# EAGLE design BlinkyTile Controller (EAGLE 7.7.0)
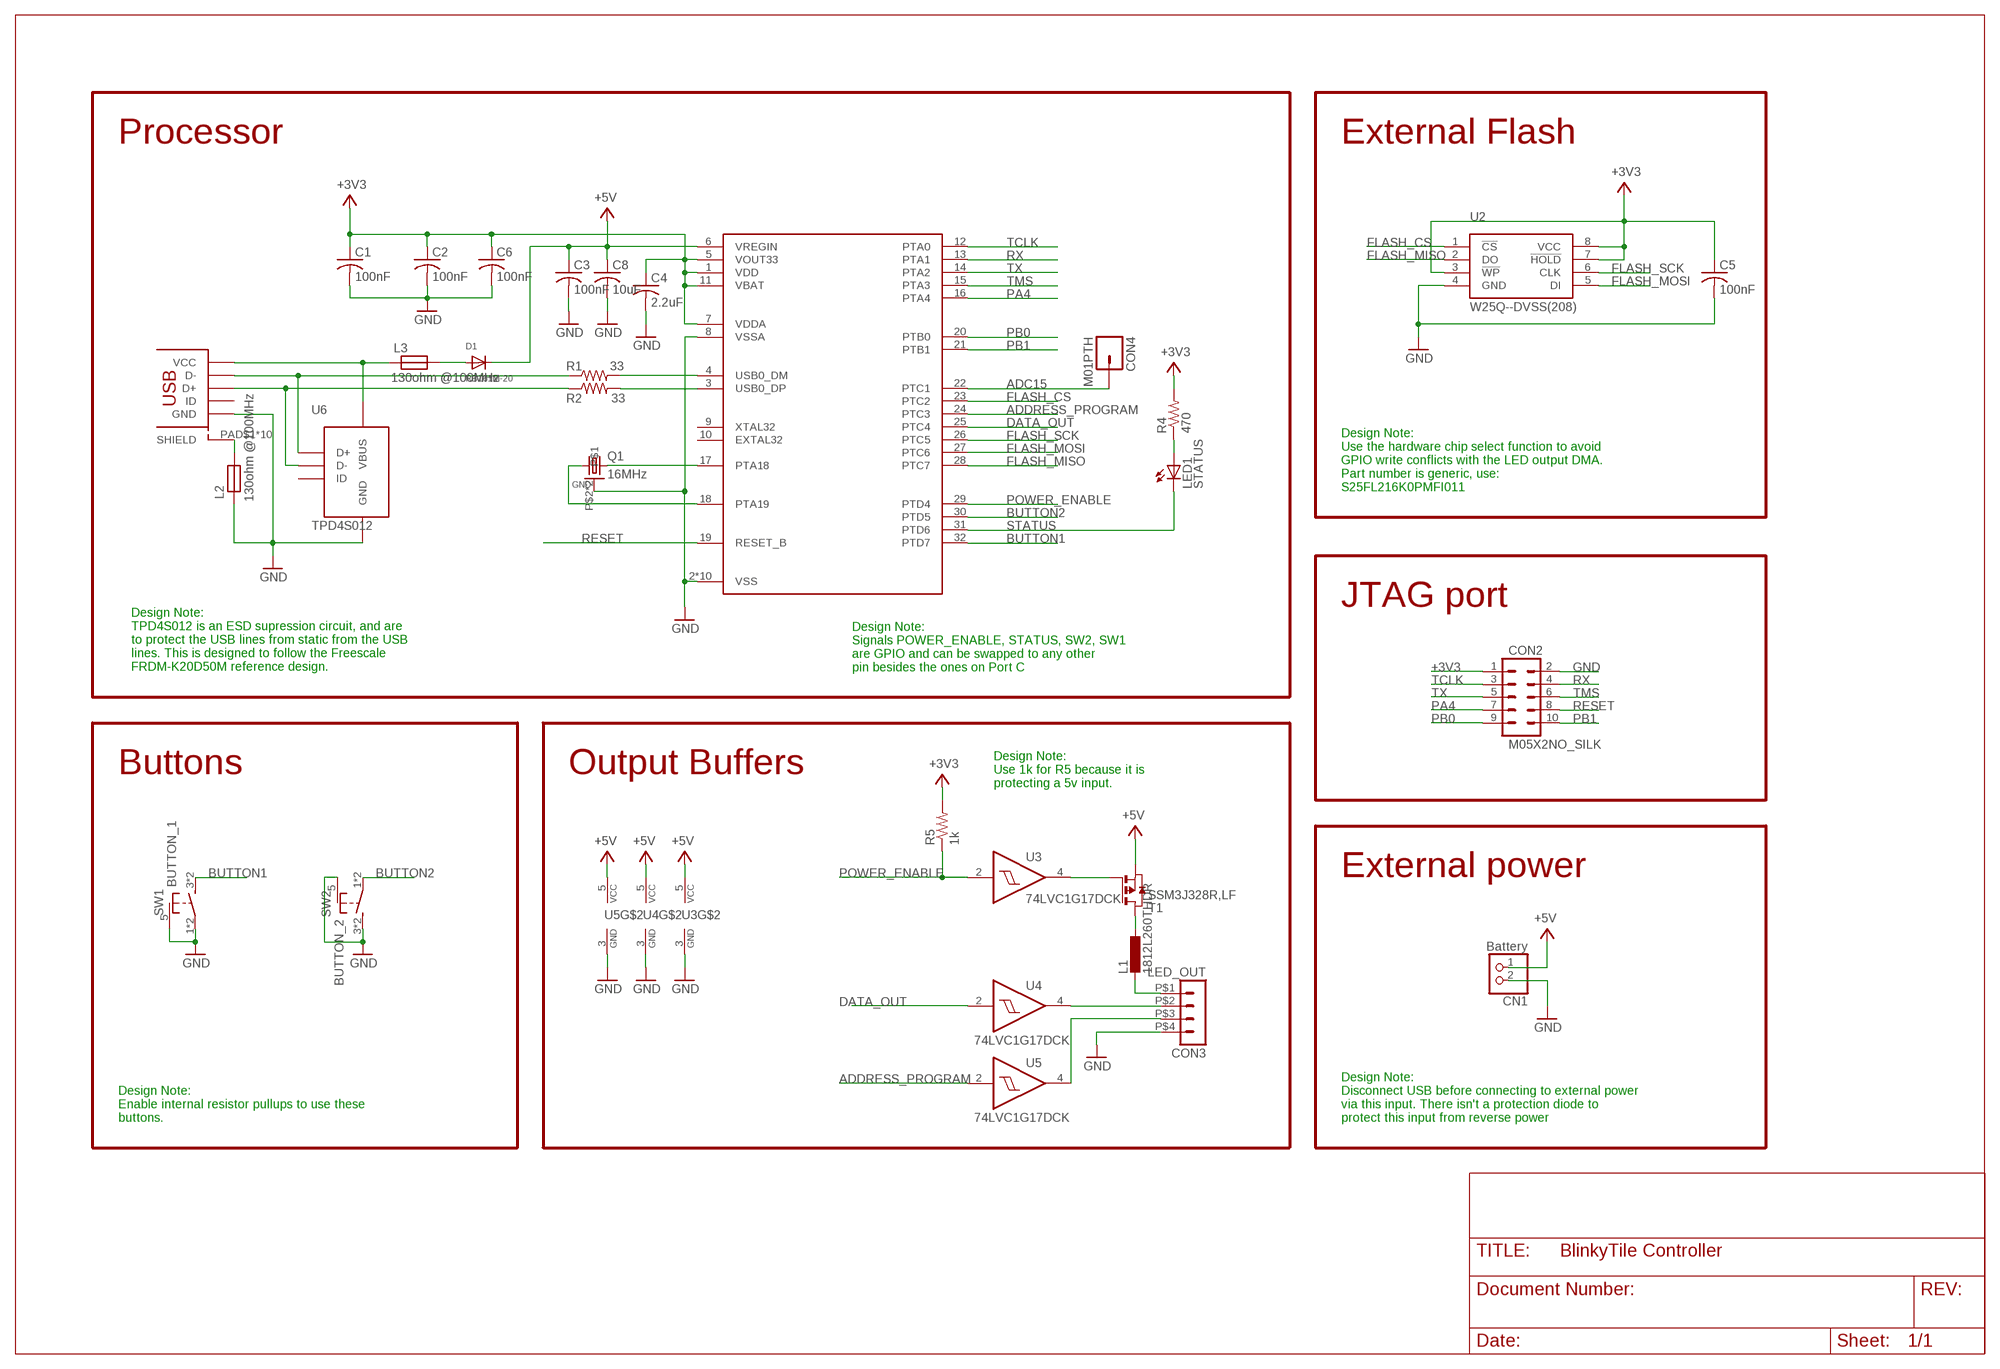
[diagram p0: schematic, sheet 1]

## Parts
C1  100nF  C-USC0402  [C0402]
C2  100nF  C-USC0402  [C0402]
C3  100nF  C-USC0402  [C0402]
C4  2.2uF  C-USC0402  [C0402]
C5  100nF  C-USC0402  [C0402]
C6  100nF  C-USC0402  [C0402]
C8  10uF  C-USC0805K  [C0805K]
CN1  Battery  JST_2PIN-THM-RA  [JST-PH-2-THM-RA]
CON1  USB_MICROSMT+THRUHULE  [USB_MICRO_THRUHOLE]
CON2  M05X2NO_SILK  [2X5_NOSILK]
CON3  LED_OUT  4-PIN_DUPONT  [DUPONT-4P]
CON4  M01PTH  [1X01]
D1  RB161M-20  DIODESOD-123  [SOD-123]
L1  1812L260THDR  L-EUL1812  [L1812]
L2  130ohm @100MHz  FB0805/NO-OUTLINE  [0805]
L3  130ohm @100MHz  FB0805/NO-OUTLINE  [0805]
LED1  STATUS  LEDCHIPLED_0805  [CHIPLED_0805]
Q1  16MHz  CRYSTAL_4PAD2520  [CRSYTAL_2520]
R1  33  R-US_R0402  [R0402]
R2  33  R-US_R0402  [R0402]
R4  470  R-US_R0402  [R0402]
R5  1k  R-US_R0402  [R0402]
SW1  BUTTON_1  BUTTON_MOMENTARY_GROUND  [TD-07XB]
SW2  BUTTON_2  BUTTON_MOMENTARY_GROUND  [TD-07XB]
T1  SSM3J328R,LF  PMOSSOT23  [SOT-23]
U1  MK20D--VFM5  [QFN32_5X5_LONGLEADS]
U2  W25Q--DVSS(208)  [SOIC8-208]
U3  74LVC1G17DCK  [SC70-5]
U4  74LVC1G17DCK  [SC70-5]
U5  74LVC1G17DCK  [SC70-5]
U6  TPD4S012  [R-PUSON-N6]

## Nets
+3V3: C1.1 C2.1 C4.1 C5.1 C6.1 CON2.1 R4.2 R5.2 U1.1(VDD) U1.5(VOUT33) U1.7(VDDA) U1.11(VBAT) U2.3(!WP) U2.7(!HOLD) U2.8(VCC)
+5V: C3.1 C8.1 CN1.1 D1.C T1.2(S) U1.6(VREGIN) U3.5(VCC) U4.5(VCC) U5.5(VCC)
ADC15: CON4.1 U1.22(PTC1)
ADDRESS_PROGRAM: U1.24(PTC3) U5.2(I)
BUTTON1: SW1.3(S) SW1.4(S) U1.32(PTD7)
BUTTON2: SW2.1(P) SW2.2(P) U1.30(PTD5)
DATA_OUT: U1.25(PTC4) U4.2(I)
FLASH_CS: U1.23(PTC2) U2.1(!CS)
FLASH_MISO: U1.28(PTC7) U2.2(DO)
FLASH_MOSI: U1.27(PTC6) U2.5(DI)
FLASH_SCK: U1.26(PTC5) U2.6(CLK)
GND: C1.2 C2.2 C3.2 C4.2 C5.2 C6.2 C8.2 CN1.2 CON1.PIN$5(GND) CON2.2 CON3.P$4 L2.2 Q1.P$2 Q1.P$4 SW1.1(P) SW1.2(P) SW1.5(SHIELD) SW2.3(S) SW2.4(S) SW2.5(SHIELD) U1.2(VSS) U1.8(VSSA) U1.PAD@1(VSS) U1.PAD@2(VSS) U1.PAD@3(VSS) U1.PAD@4(VSS) U1.PAD@5(VSS) U1.PAD@6(VSS) U1.PAD@9(VSS) U1.PAD@10(VSS) U1.PAD@11(VSS) U2.4(GND) U3.3(GND) U4.3(GND) U5.3(GND) U6.P$4(GND)
LED_DATA: CON3.P$2 U4.4(O)
N$1: Q1.P$1 U1.18(PTA19)
N$2: Q1.P$3 U1.17(PTA18)
N$3: CON1.PIN$1(VCC) L3.2 U6.P$6(VBUS)
N$4: CON3.P$3 U5.4(O)
N$5: L1.1 T1.1(D)
N$6: T1.3(G) U3.4(O)
N$7: CON1.PIN$2(D-) R1.1 U6.P$1(D+)
N$8: CON3.P$1 L1.2
N$9: D1.A L3.1
N$10: CON1.PIN$3(D+) R2.1 U6.P$2(D-)
N$11: R1.2 U1.4(USB0_DM)
N$12: R2.2 U1.3(USB0_DP)
N$16: LED1.A R4.1
PA4: CON2.7 U1.16(PTA4)
PB0: CON2.9 U1.20(PTB0)
PB1: CON2.10 U1.21(PTB1)
POWER_ENABLE: R5.1 U1.29(PTD4) U3.2(I)
RESET: CON2.8 U1.19(RESET_B)
RX: CON2.4 U1.13(PTA1)
SHIELD: CON1.PAD$1(SHIELD) CON1.PAD$2(SHIELD) CON1.PAD$3(SHIELD) CON1.PAD$4(SHIELD) CON1.PAD$5(SHIELD) CON1.PAD$6(SHIELD) CON1.PAD$7(SHIELD) CON1.PAD$8(SHIELD) CON1.PAD$9(SHIELD) CON1.PAD$10(SHIELD) L2.1
STATUS: LED1.C U1.31(PTD6)
TCLK: CON2.3 U1.12(PTA0)
TMS: CON2.6 U1.15(PTA3)
TX: CON2.5 U1.14(PTA2)
Unconnected: CON1.PIN$4(ID) U1.9(XTAL32) U1.10(EXTAL32) U6.P$3(ID)

## Notes on the sheet
- Processor | External Flash
- Design Note:
  Use the hardware chip select function to avoid
  GPIO write conflicts with the LED output DMA.
  Part number is generic, use:
  S25FL216K0PMFI011
- JTAG port
- Design Note:
  Signals POWER_ENABLE, STATUS, SW2, SW1
  are GPIO and can be swapped to any other
  pin besides the ones on Port C
- Design Note:
  TPD4S012 is an ESD supression circuit, and are
  to protect the USB lines from static from the USB
  lines. This is designed to follow the Freescale
  FRDM-K20D50M reference design.
- Buttons | Output Buffers
- Design Note:
  Use 1k for R5 because it is
  protecting a 5v input.
- External power
- Design Note:
  Enable internal resistor pullups to use these
  buttons.
- Design Note:
  Disconnect USB before connecting to external power
  via this input. There isn't a protection diode to
  protect this input from reverse power

## Library data of the parts
C1-C6 C8 = adafruit:C-US: CAPACITOR, American symbol
CN1 = adafruit:JST_2PIN: JST 2-Pin Connectors of various flavors SMT-RA (S2B-PH-SM4) 4UConnector #17311 SMT (B2B-PH-SM4) THM-RA (S2B-PH) THM (B2B-PH)
CON1 = blinkinlabs:USB_MICRO
CON2 = SparkFun-Connectors:M05X2: Header 5x2 Standard 10-pin dual row 0.1" header. Commonly used with AVR-ISP. Use with Spark Fun Electronics SKU: PRT-00778
CON3 = blinkinlabs:4-PIN_DUPONT: PIN HEADER
CON4 = SparkFun-Connectors:M01: Header 1 Standard 1-pin 0.1" header. Use with straight break away headers (SKU : PRT-00116), right angle break away headers (PRT-00553), swiss pins (PRT-00743), machine pins (PRT-00117), and female headers (PRT-00115).
D1 = adafruit:DIODE: Diode SMADIODE - SMA Surface Mount Package 20V 1A Schottky Diode Digikey: 641-1014-6-ND DO-1N4148 - Through Hole Small Current Diode SOD-123 20V 1 A (.5mV Vf) Schottky Diode - Digikey: MBRX120TPMSCT-ND SOD-323 10V 570mA (.38mV Vf, 3ns) Schottky Diode - Digikey: ZLLS410CT-ND SOD-523 30V 30mA Schottky Diode (RB751S-40TE61) - Digikey: RB751S-40TE61CT-ND SOT23-R/W - SOT23 Package (R = Solder Paste/Reflow Ovens, W = Hand-Soldering) BAT54Film 40V 300mA - Digikey: 497-7162-1-ND
L1 = rcl:L-EU: INDUCTOR, European symbol
L2 L3 = blinkinlabs:FB
LED1 = adafruit:LED: LED OSRAM: - CHIPLED LG R971, LG N971, LY N971, LG Q971, LY Q971, LO R971, LY R971 LH N974, LH R974 LS Q976, LO Q976, LY Q976 LO Q996 - Hyper CHIPLED LW Q18S LB Q993, LB Q99A, LB R99A - SideLED LS A670, LO A670, LY A670, LG A670, LP A670 LB A673, LV A673, LT A673, LW A673 LH A674 LY A675 LS A676, LA A676, LO A676, LY A676, LW A676 LS A679, LY A679, LG A679 - Hyper Micro SIDELED® LS Y876, LA Y876, LO Y876, LY Y876 LT Y87S - SmartLED LW L88C, LW L88S LB L89C, LB L89S, LG L890 LS L89K, LO L89K, LY L89K LS L896, LA L896, LO L896, LY L896 - TOPLED LS T670, LO T670, LY T670, LG T670, LP T670 LSG T670, LSP T670, LSY T670, LOP T670, LYG T670 LG T671, LOG T671, LSG T671 LB T673, LV T673, LT T673, LW T673 LH T674 LS T676, LA T676, LO T676, LY T676, LB T676, LH T676, LSB T676, LW T676 LB T67C, LV T67C, LT T67C, LS T67K, LO T67K, LY T67K, LW E67C LS E67B, LA E67B, LO E67B, LY E67B, LB E67C, LV E67C, LT E67C LW T67C LS T679, LY T679, LG T679 LS T770, LO T770, LY T770, LG T770, LP T770 LB T773, LV T773, LT T773, LW T773 LH T774 LS E675, LA E675, LY E675, LS T675 LS T776, LA T776, LO T776, LY T776, LB T776 LHGB T686 LT T68C, LB T68C - Hyper Mini TOPLED® LB M676 - Mini TOPLED Santana® LG M470 LS M47K, LO M47K, LY M47K Source: http://www.osram.convergy.de/
Q1 = blinkinlabs:CRYSTAL_4PAD
R1 R2 R4 R5 = adafruit:R-US_: RESISTOR, American symbol
SW1 SW2 = blinkinlabs:BUTTON_MOMENTARY_GROUND
T1 = zetex:PMOSSOT23: MOS FET; OC_FARNELL: unknown; OC_NEWARK: unknown
U1 = blinkinlabs:MK20D--VFM5
U2 = blinkinlabs:W25Q--DV: Footprint for the Winbond W25Qxx series of flash chips. These are notable in that they can be reprogrammed in 256-byte sections, which makes them easy to program in-circuit using processors with constrained resources.
U3-U5 = 74xx-little-us:74*1G17: Single Schmitt-Trigger Buffer
U6 = blinkinlabs:TPD4S012: TPD4S012 4-Channel ESD Solution for USB-HS/USB OTG/USB Charger Interface

## Board
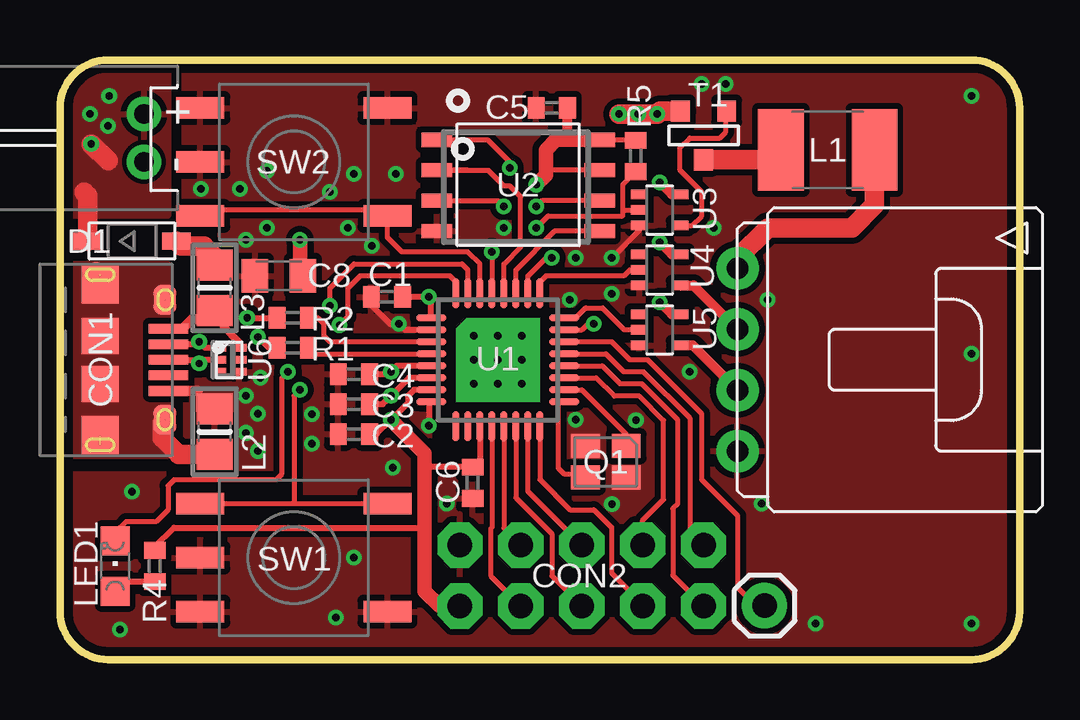
[diagram p1: board, top side]
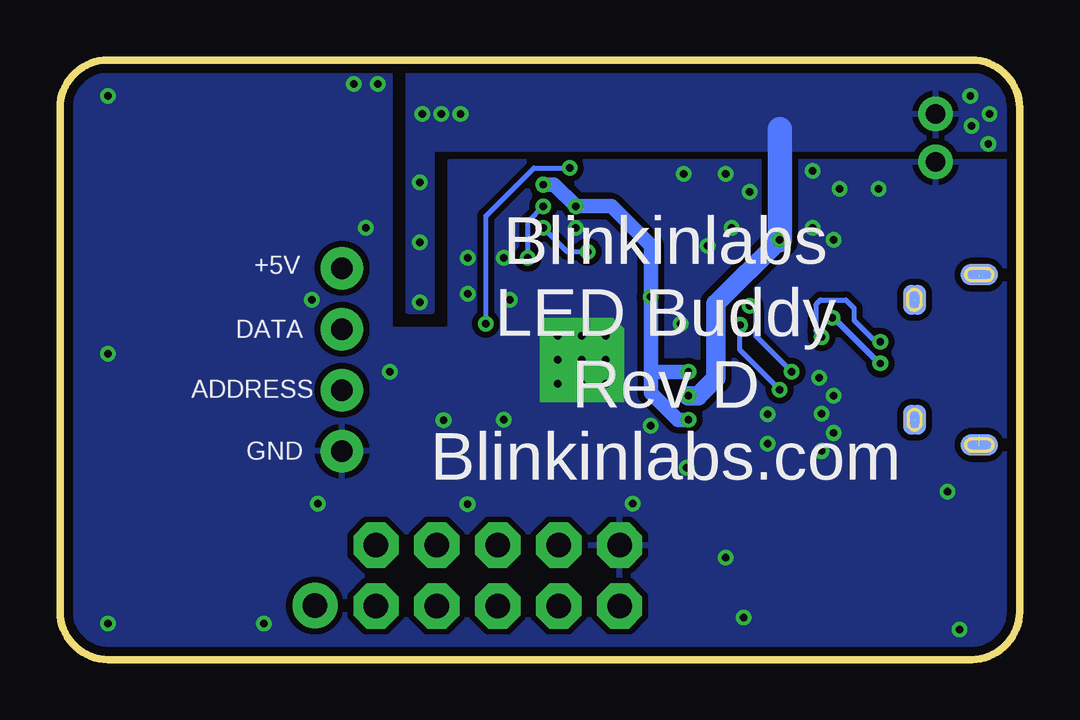
[diagram p2: board, bottom side, seen from below]

Size 40 x 25 mm. Coordinates in mm from the lower left corner, seen from the top.
Outline: 2,0 38,0 arc90 40,2 40,23 arc90 38,25 2,25 arc90 0,23 0,2 arc90 2,0
Copper layers (1*16): Top 0.0356mm / dielectric 1.5011mm / Bottom 0.0356mm
Design rules "BlinkyTape *": minimum track width 8mil, minimum drill 0.3mm, track to track 8mil, track to pad 8mil, pad to pad 8mil, via to via 8mil, smd to smd 8mil, copper to edge 15mil, drill to drill 0.25mm, minimum pad ring 7mil, minimum via ring 7mil, stop-mask expansion 2mil, vias tented up to drill 3mm, thermal gap 10mil
tRestrict: area 20.2,9.5 to 20.5,10.5; area 20,10.5 to 20.2,14.5; area 16.2,10.5 to 20.2,10.7; area 16.2,10.5 to 16.5,14.5; area 16.2,14.3 to 20.2,14.5; area 15.8,9 to 16.2,10.5

### Footprints (pad centres in the part's own frame; a part is rotated, then mirrored left to right if it is on the bottom)
C0402 = smd 0.7 x 0.9: 1 -0.65,0; 2 0.65,0
C0805K = smd 1.1 x 1.4: 1 -1,0; 2 1,0
JST-PH-2-THM-RA = drill 0.8 pad 1.422: 1 1,0; 2 -1,0
USB_MICRO_THRUHOLE = smd 1.645 x 1.55: PAD$1 -3.172,0; PAD$4 3.172,0 | smd 1.5 x 1.55: PAD$2 -1,0; PAD$3 1,0 | smd 1.25 x 0.95: PAD$5 -2.5,2.7; PAD$6 2.5,2.7 | smd 0.9 x 1.55 bottom: PAD$7 -3.55,0; PAD$8 3.55,0 | smd 1.25 x 0.95 bottom: PAD$9 -2.5,2.7; PAD$10 2.5,2.7 | smd 0.4 x 1.65: PIN$1 -1.3,2.85; PIN$2 -0.65,2.85; PIN$3 0,2.85; PIN$4 0.65,2.85; PIN$5 1.3,2.85
2X5_NOSILK = drill 1.016 pad 1.88 octagon: 1 -1.27,5.08; 2 1.27,5.08; 3 -1.27,2.54; 4 1.27,2.54; 5 -1.27,0; 6 1.27,0; 7 -1.27,-2.54; 8 1.27,-2.54; 9 -1.27,-5.08; 10 1.27,-5.08
DUPONT-4P = drill 0.9 pad 1.778: P$1 -3.81,0; P$2 -1.27,0; P$3 1.27,0; P$4 3.81,0
1X01 = drill 1.016 pad 1.88: 1 0,0
SOD-123 = smd 1.2 x 0.7: A 1.85,0; C -1.85,0
L1812 = smd 1.9 x 3.4: 1 -1.95,0; 2 1.95,0
0805 = smd 1.3 x 1.5: 1 -0.95,0; 2 0.95,0
CHIPLED_0805 = smd 1.2 x 1.2: A 0,-1.05; C 0,1.05
CRSYTAL_2520 = smd 1.2 x 1: P$1 -0.85,-0.65; P$2 0.85,-0.65; P$3 0.85,0.65; P$4 -0.85,0.65
R0402 = smd 0.7 x 0.9: 1 -0.65,0; 2 0.65,0
TD-07XB = smd 2 x 0.9: 1 -3.9,-2.25; 2 3.9,-2.25; 3 -3.9,2.25; 4 3.9,2.25; 5 -3.9,0
SOT-23 = smd 0.787 x 0.889: 1 0.025,-1.016; 2 -0.94,1.016; 3 0.991,1.016
QFN32_5X5_LONGLEADS = smd 1.25 x 0.275: 1 -2.775,1.75; 2 -2.775,1.25; 3 -2.775,0.75; 4 -2.775,0.25; 5 -2.775,-0.25; 6 -2.775,-0.75; 7 -2.775,-1.25; 8 -2.775,-1.75; 17 2.775,-1.75; 18 2.775,-1.25; 19 2.775,-0.75; 20 2.775,-0.25; 21 2.775,0.25; 22 2.775,0.75; 23 2.775,1.25; 24 2.775,1.75 | smd 0.275 x 1.25: 9 -1.75,-2.775; 10 -1.25,-2.775; 11 -0.75,-2.775; 12 -0.25,-2.775; 13 0.25,-2.775; 14 0.75,-2.775; 15 1.25,-2.775; 16 1.75,-2.775; 25 1.75,2.775; 26 1.25,2.775; 27 0.75,2.775; 28 0.25,2.775; 29 -0.25,2.775; 30 -0.75,2.775; 31 -1.25,2.775; 32 -1.75,2.775 | drill 0.3 pad 1.5 octagon: PAD@1 -1,1 | drill 0.3 pad 1.5 square: PAD@2 0,1; PAD@3 1,0; PAD@4 1,1; PAD@5 -1,0; PAD@6 0,0; PAD@9 -1,-1; PAD@10 0,-1; PAD@11 1,-1
SOIC8-208 = smd 0.6 x 1.27: 1 -1.875,-3.39; 2 -0.605,-3.39; 3 0.665,-3.39; 4 1.935,-3.39; 5 1.935,3.39; 6 0.665,3.39; 7 -0.605,3.39; 8 -1.875,3.39
SC70-5 = smd 0.4 x 0.7: 1 -0.65,-0.85; 2 0,-0.85; 3 0.65,-0.85; 4 0.65,0.85; 5 -0.65,0.85
R-PUSON-N6 = smd 0.3 x 0.6: P$1 -0.5,-0.425; P$2 0,-0.425; P$3 0.5,-0.425; P$4 0.5,0.425; P$5 0,0.425; P$6 -0.5,0.425

### Placement (x,y rotation side)
C1  13.62,15.12 180 top
C2  12.25,9.4 180 top
C3  12.25,10.65 180 top
C4  12.25,11.9 180 top
C5  20.5,23 180 top
C6  17.2,7.38 270 top
C8  9.12,16 180 top
CN1  3.5,21.75 90 top
CON1  1.68,12.5 270 top
CON2  21.75,3.5 90 top
CON3  28.25,12.5 270 top
CON4  29.37,2.25 0 top
D1  3,17.45 0 top
L1  32,21.25 0 top
L2  6.45,9.5 90 top
L3  6.45,15.5 270 top
LED1  2.3,3.9 0 top
Q1  22.75,8.25 180 top
R1  9.7,13 0 top
R2  9.7,14.25 0 top
R4  3.95,3.9 90 top
R5  24,21 90 top
SW1  9.75,4.25 0 top
SW2  9.75,20.75 0 top
T1  26.8,21.85 0 top
U1  18.25,12.5 0 top
U2  19.1,19.8 270 top
U3  25,18.75 270 top
U4  25,16.25 270 top
U5  25,13.75 270 top
U6  7.05,12.5 270 top

### Tracks (layer width: path | path; a pad name or v marks a point on that pad's centre or on a via)
+3V3  (via drill 0.3)
  Top 0.203: 15.22,8.53 15.2,8.5 | U2.3 18.27,19.14 v18.5,18.9 | U2.8 23.98,21.68 R5.2 | U2.7 20.34,20.41 20.25,20.5
  Top 0.254: U1.1 15.47,15.03 v15.38,15.12 C1.1 | U1.5 14.05,12.25 v13.8,12 13.7,11.9 C4.1 | U1.7 14.75,11.25 14.5,11 14.5,10.7 v13.8,10 13.2,9.4 C2.1 | U1.11 17.5,8.32 C6.1 15.22,8.03 15.2,8 | 15.2,5.5 4.75,5.5 3.95,4.7 R4.2
  Top 0.406: U2.8 21.43,21.68 21.15,21.95 C5.1
  Top 0.61: v13.8,10 15.2,8.6 15.2,8.5 15.2,8 15.2,5.5 15.2,2.85 15.82,2.23 CON2.1 | v19.85,19.8 20.25,20.2 20.25,20.5 20.25,21.25 20.68,21.68 U2.8
  Bottom 0.61: 15.38,12 v15.38,15.12 15.38,17.26 17.02,18.9 v18.5,18.9 19.4,19.8 v19.85,19.8 | v13.8,12 15.38,12 | 15.38,12 15.38,11.12 14.25,10 v13.8,10
+5V  (via drill 0.3)
  Top 0.254: U1.6 14.55,11.75 v13.8,11 | 13.55,10.75 v13.8,11 | C3.1 13.45,10.65 v13.8,11
  Top 0.406: v25,17.4 25.5,16.9 U4.5 | v25,14.9 25.5,14.4 U5.5 | v25,19.9 25.5,19.4 U3.5
  Top 0.61: v10,17.5 10,16.12 C8.1
  Top 0.813: v23.3,22.75 v24.9,22.75 25.02,22.87 T1.2 | 1.55,21.25 v1.3,21.5 2,20.8 | D1.C 1.15,19.35 1,19.5
  Bottom 0.813: v13.8,11 13.4,11 12.65,11.75 12.65,14.85 v10,17.5
  Bottom 1.016: v10,17.5 10,22.12
  other vias: 24.1,22.75 2,22.25 1.25,22.75 2.05,23.5
  pour Bottom (isolate 0.254): 0,27 25.5,27 25.5,14.54 24.5,14.54 24.5,21.3 0,21.3
  pour Top: 0,24.5 4.5,24.5 4.5,18.5 0,18.5
ADC15
  Top 0.203: U1.22 23,13.25 23.75,12.5 24.5,12.5 26.75,10.25 26.75,7.5 28.25,6 28.25,3 29,2.25 CON4.1
ADDRESS_PROGRAM
  Top 0.203: U1.24 21.5,14.25 21.91,14.66 22.62,14.66 23.53,13.75 U5.2
BUTTON1  (via drill 0.3)
  Top 0.203: U1.32 16.5,15.75 16.25,16 12.5,16 12,15.5 12,14.3 v11.65,13.95 | v10,11.25 9.75,11 9.75,6.5 | SW1.4 9.75,6.5 | 9.75,6.5 SW1.3
  Bottom 0.203: v10,11.25 11.65,12.9 v11.65,13.95
BUTTON2
  Top 0.203: SW2.1 6.5,18.5 6.5,18.75 13,18.75 13,18.5 SW2.2 13.65,17.6 14.25,17 17,17 17.5,16.5 U1.30
DATA_OUT
  Top 0.203: U4.2 23.75,16.25 23.5,16 20.25,16 20,15.75 U1.25
FLASH_CS  (via drill 0.3)
  Top 0.203: U1.23 21.75,13.75 22,14 v22.25,14 | U2.1 17.82,21.68 18.75,20.75 v18.75,20.5
  Bottom 0.203: v22.25,14 22.25,18.5 20.25,20.5 v18.75,20.5
FLASH_MISO
  Top 0.203: 17,20.41 U2.2 17.84,20.41 18.5,19.75 18.75,19.75 19.2,19.3 19.2,17.2 18.5,16.5 U1.28
FLASH_MOSI
  Top 0.203: U1.27 19,16.25 20.61,17.86 U2.5
FLASH_SCK  (via drill 0.3)
  Top 0.203: U1.26 19.5,16 20.25,16.75 v20.5,16.75 | U2.6 20.09,19.14 v19.85,18.9
  Bottom 0.203: v20.5,16.75 20.5,18.25 v19.85,18.9
GND  (via drill 0.3)
  Top 0.203: U3.3 24.15,17.9 v23,16.75
  Top 0.254: C1.2 12.97,14.78 13.75,14 v14.12,14 14.38,13.75 U1.2 | U1.8 15.38,10.65 v15.38,9.75
  Top 0.406: 5.75,11.2 CON1.PIN$5
  other vias: 21.5,10 21.25,15 10.5,9 29.25,6.5 23.01,6.48 18.5,18 13.88,8 8.62,18 10.5,10.22 5.88,19.62 7.5,19.62 8.62,20.38 7.75,11 12.25,4.25 7.75,17.5 24.01,9.98 38,1.5 23,15.25 21.5,16.75 12,18 27.75,24 26.75,24 11.25,19.5 14,20.25 13,17.25 31.5,1.5 38,23.5 29.5,15 27.25,18 16.12,6.5 2.5,1.25 11.5,1.75 12.25,20.25 38,12.75 8.25,10.25 7.75,9.45 8.25,8.7 3,7 8.35,11.75 26.25,12
  pour Top (isolate 0.254): 5.2,27 47.62,27 47.62,-2.5 -2.5,-2.5 -2.5,7.75 5.25,7.75 5.25,17.25 5.2,17.25
  pour Bottom (isolate 0.254): 23.75,13.75 26.25,13.75 26.25,27 47.12,27 47.12,-2.5 -1.5,-2.5 -1.5,11.21 -1.44,19.5 -1.44,20.75 23.75,20.75
  pour Top (no thermals): 5.5,11.3 7.5,11.3 7.5,10.5 5.5,10.5
LED_DATA
  Top 0.406: U4.4 26.42,15.6 CON3.P$2
N$1
  Top 0.203: U1.18 21.75,11.25 23.6,9.4 Q1.P$1
N$2
  Top 0.203: Q1.P$3 21.75,7.75 21,7.75 20.77,7.97 20.77,10.75 U1.17
N$3
  Top 0.254: 6.75,14.25 L3.2
  Top 0.305: U6.P$6 7.47,13.22 6.8,13.9 6.8,14.2 L3.2
  Top 0.406: CON1.PIN$1 5.11,13.8 5.5,14.19 6.09,14.19 L3.2
N$4
  Top 0.406: U5.4 26.38,13.1 CON3.P$3 28.23,11.23
N$5
  Top 0.813: L1.1 29.63,20.83 T1.1
N$6
  Top 0.203: U3.4 26.35,18.1 26.75,18.5 26.75,19.5 25.85,20.4 25.85,21.35 26.25,21.75 27.5,21.75 27.75,22 27.75,22.82
  Top 0.406: 27.75,22.82 T1.3
N$7  (via drill 0.3)
  Top 0.254: CON1.PIN$2 5.7,13.15 v5.8,13.25 6.05,13 U6.P$1 | R1.1 8.7,13 v8.25,13.45
  Bottom 0.203: v5.8,13.25 6,13.25 6.9,14.15 6.9,14.65 7.25,15 8.3,15 8.5,14.8 8.5,13.7 v8.25,13.45
N$8
  Top 0.813: CON3.P$1 28.25,16.75 29.5,18 33,18 33.95,18.95 L1.2
N$9
  Top 0.813: L3.1 6.45,16.8 6,17.25 5.05,17.25 D1.A
N$10  (via drill 0.3)
  Top 0.254: v7.8,14.25 R2.1 | CON1.PIN$3 5.65,12.5 v5.8,12.35 5.95,12.5 U6.P$2
  Bottom 0.254: v5.8,12.35 5.85,12.35 7.75,14.25 v7.8,14.25
N$11
  Top 0.203: R1.2 10.6,12.75 U1.4
N$12
  Top 0.203: U1.3 11.25,13.25 11,13.5 11,14 10.75,14.25 R2.2 10.3,14.25
N$16
  Top 0.254: R4.1 2.7,3.25 LED1.A
PA4
  Top 0.203: U1.16 20,7.51 21.26,6.25 22.25,6.25 23,5.5 23,3.6 24.29,2.31 CON2.7
PB0
  Top 0.203: U1.20 22.61,12.25 23.36,11.5 24.25,11.5 25.75,10 25.75,6.5 25.55,6.3 25.55,3.51 CON2.9
PB1
  Top 0.203: U1.21 22.75,12.75 23.5,12 24.33,12 26.25,10.08 26.25,5.35 CON2.10
POWER_ENABLE  (via drill 0.3)
  Top 0.203: v18,17 U1.29 | 23.45,18.75 U3.2 | v19.85,18 20.35,18.5 23.45,18.5 23.45,18.75 | 23.45,18.75 23.45,19.8 R5.1
  Bottom 0.203: v18,17 18.85,17 v19.85,18
RESET
  Top 0.203: CON2.8 24.29,5.8 25.16,6.67 25.16,9.98 24.15,10.98 23.11,10.98 22.34,11.75 U1.19
RX
  Top 0.203: U1.13 18.5,5.48 CON2.4
SHIELD  (4 unrouted)
  Top 0.813: 1.5,16.18 1.68,16 | L2.1 4.95,8.55 4.25,9.25 4.25,9.88 CON1.PAD$10
  pour Top (isolate 0.254): -2.5,16.5 -2.5,8.5 4.5,8.5 4.5,16.5
STATUS  (via drill 0.3)
  Top 0.203: U1.31 17,16.25 16.75,16.5 12.25,16.5 11.25,15.5 v11.25,14.75 | LED1.C 2.3,5.3 2.75,5.75 4,5.75 4.5,6.25 4.5,7.25 4.75,7.5 9,7.5 9.25,7.75 9.25,11.75 v9.5,12
  Bottom 0.203: v9.5,12 11,13.5 11,14.5 v11.25,14.75
TCLK
  Top 0.203: U1.12 18,5.5 17.95,5.45 17.95,3.49 CON2.3
TMS
  Top 0.203: CON2.6 19.5,7.02 U1.15
TX
  Top 0.203: CON2.5 20.5,3.48 20.5,5.25 19,6.75 U1.14

### Text on the board
bNames: +5V | DATA | Blinkinlabs / LED Buddy / Rev D / Blinkinlabs.com | ADDRESS | GND
tDocu: CON3